# EAGLE design 240x240_v4 (EAGLE 9.6.2)
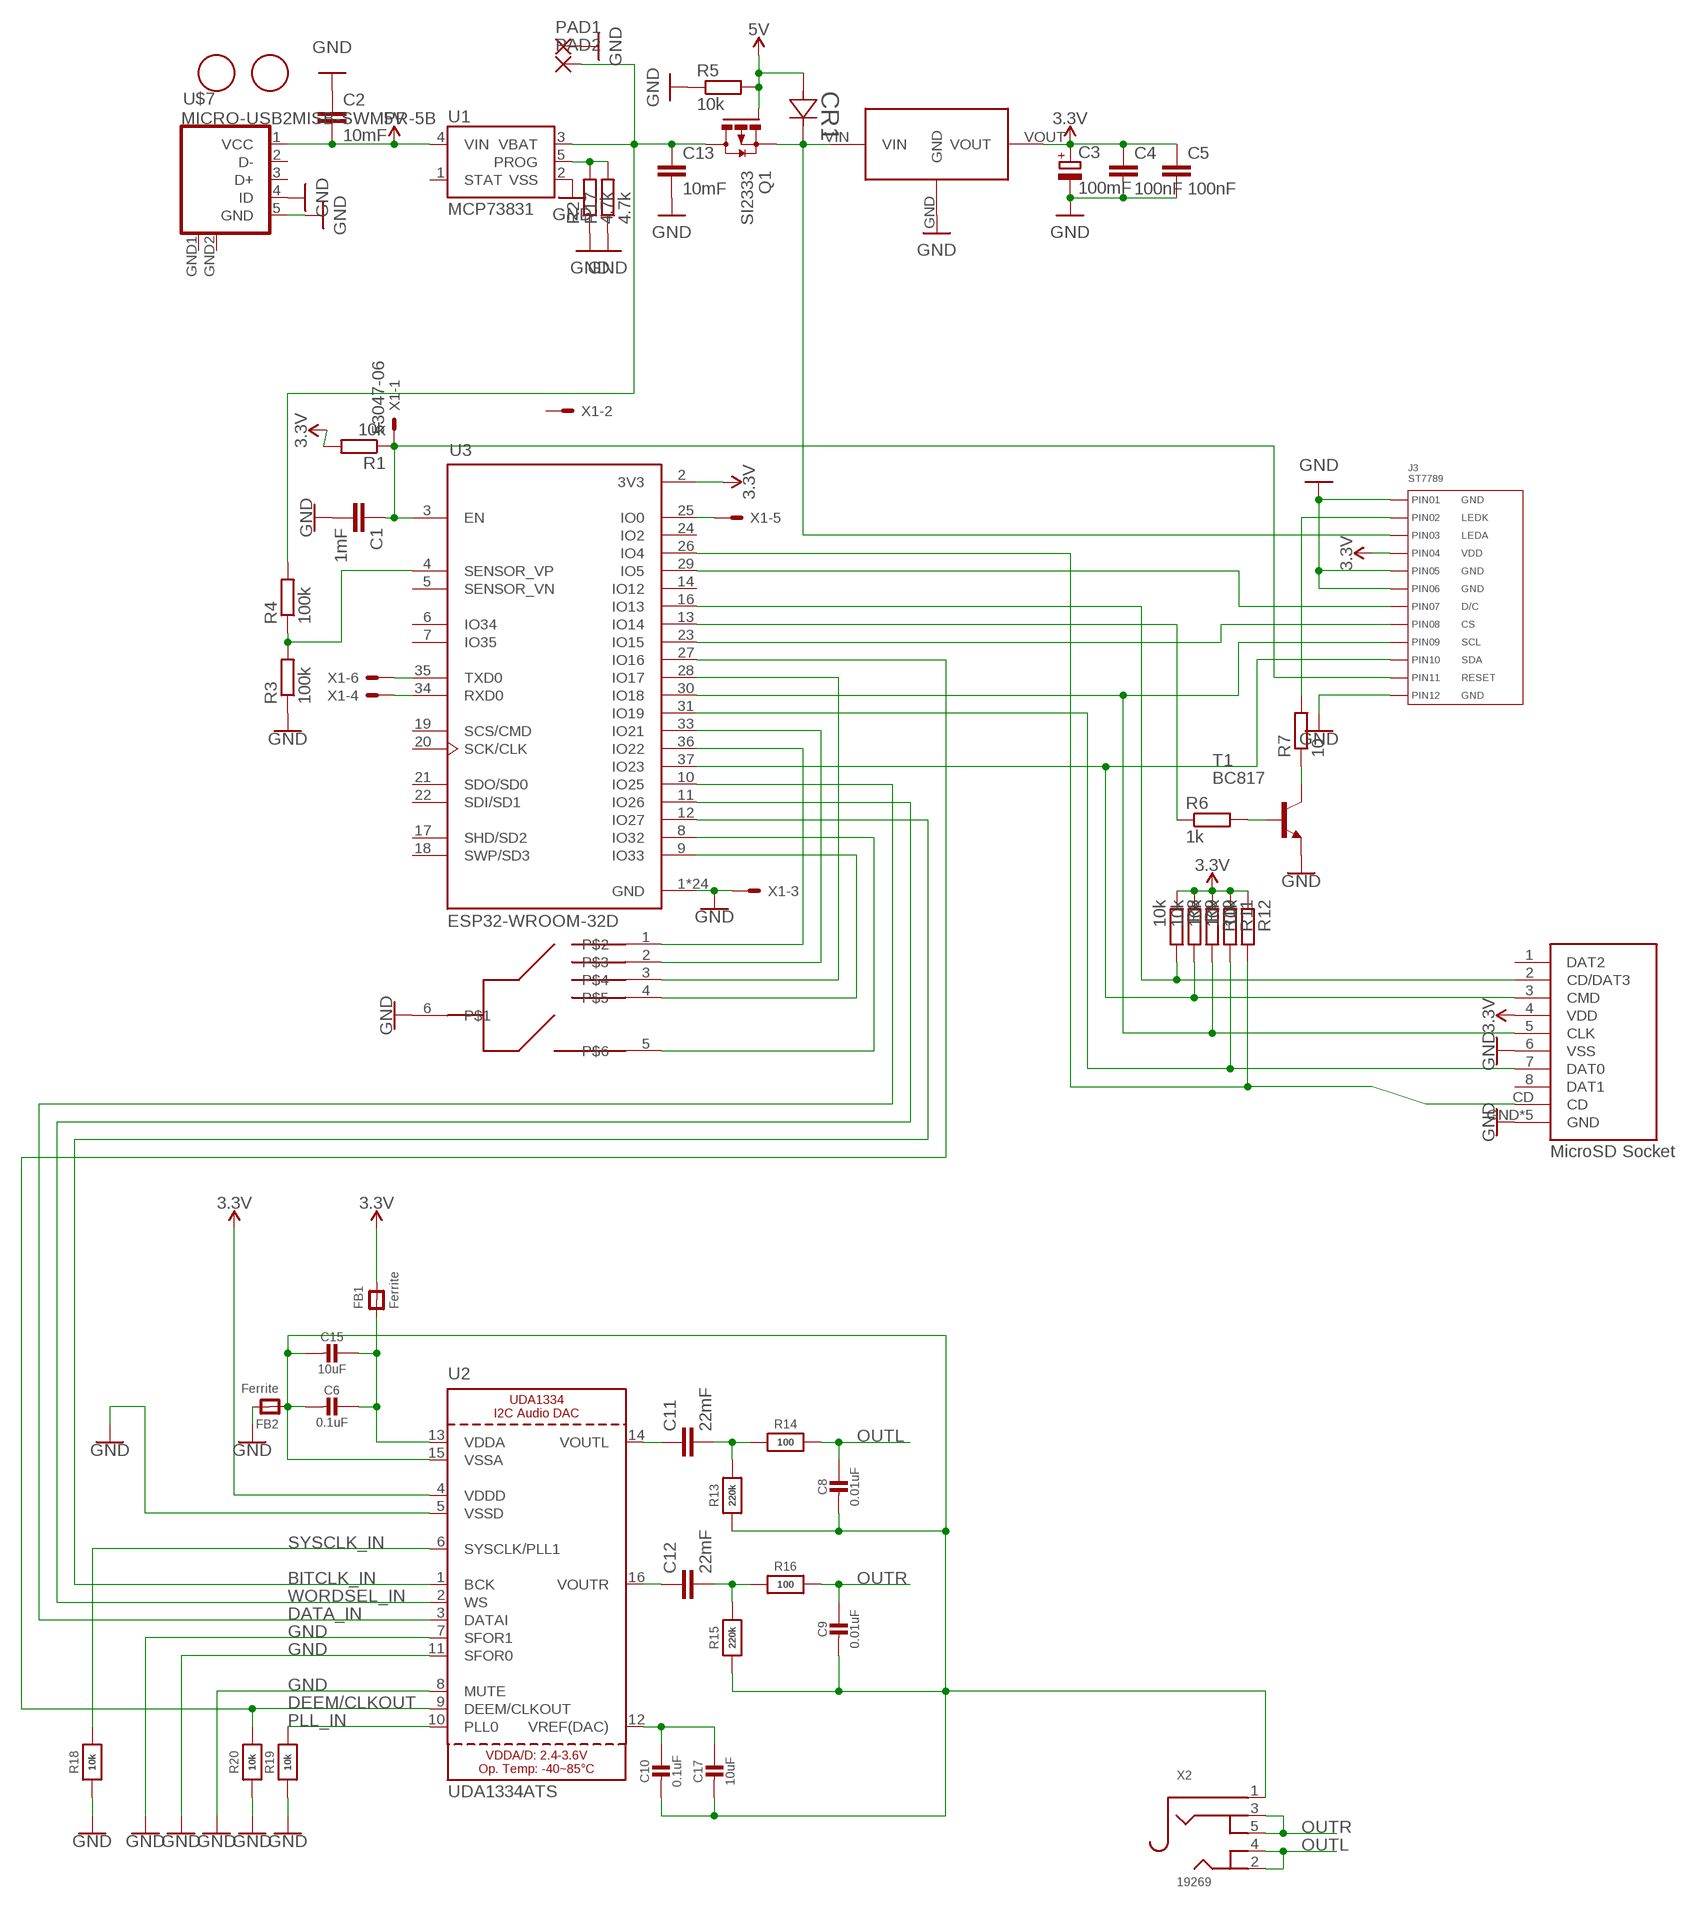
[diagram p0: schematic, sheet 1]

## Parts
C1  1mF  C-EUC0603  [C0603]
C2  10mF  C-EUC0603  [C0603]
C3  100mF  CPOL-EUSMCB  [SMC_B]
C4  100nF  C-EUC0805K  [C0805K]
C5  100nF  C-EUC0805K  [C0805K]
C6  0.1uF  CAP_CERAMIC0805-NOOUTLINE  [0805-NO]
C8  0.01uF  CAP_CERAMIC0805-NOOUTLINE  [0805-NO]
C9  0.01uF  CAP_CERAMIC0805-NOOUTLINE  [0805-NO]
C10  0.1uF  CAP_CERAMIC0805-NOOUTLINE  [0805-NO]
C11  22mF  C-EUC1210  [C1210]
C12  22mF  C-EUC1210  [C1210]
C13  10mF  C-EUC0603  [C0603]
C15  10uF  CAP_CERAMIC0805-NOOUTLINE  [0805-NO]
C17  10uF  CAP_CERAMIC0805-NOOUTLINE  [0805-NO]
CR1  BAT48  BAT48ZFILMSOD-123_STM-M  [SOD-123_STM-M]
FB1  Ferrite  FERRITE0805  [0805]
FB2  Ferrite  FERRITE0805  [0805]
J3  ST7789  CON_01X12_ST7789_CONNECTOR  [ST7789_CONNECTOR]
PAD1  SMD2  [SMD1,27-2,54]
PAD2  SMD2  [SMD1,27-2,54]
Q1  SI2333  FDN360P  [SUPER-SOT3]
R1  10k  R-EU_R0603  [R0603]
R2  4.7k  R-EU_R0805  [R0805]
R3  100k  R-EU_R0603  [R0603]
R4  100k  R-EU_R0603  [R0603]
R5  10k  R-EU_R0603  [R0603]
R6  1k  R-EU_R0603  [R0603]
R7  10  R-EU_R0805  [R0805]
R8  10k  R-EU_R0603  [R0603]
R9  10k  R-EU_R0603  [R0603]
R10  10k  R-EU_R0603  [R0603]
R11  10k  R-EU_R0603  [R0603]
R12  10k  R-EU_R0603  [R0603]
R13  220k  RESISTOR0805_NOOUTLINE  [0805-NO]
R14  100  RESISTOR0805_NOOUTLINE  [0805-NO]
R15  220k  RESISTOR0805_NOOUTLINE  [0805-NO]
R16  100  RESISTOR0805_NOOUTLINE  [0805-NO]
R17  4.7k  R-EU_R0805  [R0805]
R18  10k  RESISTOR_0603_NOOUT  [0603-NO]
R19  10k  RESISTOR_0603_NOOUT  [0603-NO]
R20  10k  RESISTOR_0603_NOOUT  [0603-NO]
T1  BC817  BC817-16-NPN-SOT23-BEC  [SOT23-BEC]
U1  MCP73831  [SOT23-5]
U2  UDA1334ATS  AUDIO_I2S_UDA1334""  [SSOP16_4.4MM]
U3  ESP32-WROOM-32D  [MODULE_ESP32-WROOM-32D]
U$1  XC6203  HT7333  [SOT89]
U$2  B5-P5S-0D  [B5-P5S-0D-Z]
U$3  FIDUCIAL  [FIDUCIAL_1MM]
U$4  FIDUCIAL  [FIDUCIAL_1MM]
U$5  ATTEND_MICROSD_SOCKET  [ATTEND_MICROSD_SOCKET]
U$7  MICRO-USB2MISB-SWMPR-5B  [MICRO-USB2]
X1  53047-06  [53047-06]
X2  19269  AUDIO_3.5MMJACK  [4UCONN_19269]

## Nets
3.3V [Power]: C3.+ C4.1 C5.1 FB1.2 J3.P$4 R1.2 R8.1 R9.1 R10.1 R11.1 R12.1 U2.4(VDDD) U3.2(3V3) U$1.VOUT U$5.4(VDD)
5V [Power]: C2.2 CR1.1 Q1.1(G) R5.2 U1.4(VIN) U$7.1(VCC)
BITCLK_IN: U2.1(BCK) U3.12(IO27)
DATA_IN: U2.3(DATAI) U3.10(IO25)
DEEM/CLKOUT: R20.2 U2.9(DEEM/CLKOUT) U3.27(IO16)
GND [Power]: C1.2 C2.1 C3.- C4.2 C5.2 C13.2 FB2.2 J3.P$1 J3.P$5 J3.P$6 J3.P$12 PAD1.1(P) R2.1 R3.1 R5.1 R17.1 R18.1 R19.1 R20.1 T1.E U1.2(VSS) U2.5(VSSD) U2.7(SFOR1) U2.8(MUTE) U2.11(SFOR0) U3.1(GND) U3.15(GND) U3.38(GND) U3.39_1(GND) U3.39_2(GND) U3.39_3(GND) U3.39_4(GND) U3.39_5(GND) U3.39_6(GND) U3.39_7(GND) U3.39_8(GND) U3.39_9(GND) U3.39_10(GND) U3.39_11(GND) U3.39_12(GND) U3.39_13(GND) U3.39_14(GND) U3.39_15(GND) U3.39_16(GND) U3.39_17(GND) U3.39_18(GND) U3.39_19(GND) U3.39_20(GND) U3.39_21(GND) U$1.GND U$2.6 U$5.6(VSS) U$5.GND U$5.GND2(GND) U$5.GND3(GND) U$5.GND4(GND) U$5.GND5(GND) U$7.4(ID) U$7.5(GND) X1.3
N$1: C1.1 J3.P$11 R1.1 U3.3(EN) X1.1
N$2: J3.P$9 R10.2 U3.30(IO18) U$5.5(CLK)
N$3: J3.P$10 R9.2 U3.37(IO23) U$5.3(CMD)
N$5: J3.P$7 U3.29(IO5)
N$6: J3.P$8 U3.23(IO15)
N$7: U3.35(TXD0) X1.6
N$8: U3.34(RXD0) X1.4
N$9: R3.2 R4.1 U3.4(SENSOR_VP)
N$10: R6.2 T1.B
N$11: U3.36(IO22) U$2.1
N$12: R2.2 R17.2 U1.5(PROG)
N$13: J3.P$2 R7.2
N$14: U3.33(IO21) U$2.2
N$15: U3.28(IO17) U$2.3
N$16: U3.9(IO33) U$2.4
N$17: U3.8(IO32) U$2.5
N$18: R11.2 U3.31(IO19) U$5.7(DAT0)
N$19 [Power]: C13.1 PAD2.1(P) Q1.3(D) R4.2 U1.3(VBAT)
N$20: U3.25(IO0) X1.5
N$21: R7.1 T1.C
N$22: R6.1 U3.13(IO14)
N$23: R8.2 U3.16(IO13) U$5.2(CD/DAT3)
N$24: R12.2 U3.26(IO4) U$5.CD
N$25: C6.1 C15.1 FB1.1 U2.13(VDDA)
N$26: C11.2 R13.2 R14.1
N$27: C12.2 R15.2 R16.1
N$28: C10.1 C17.1 U2.12(VREF(DAC))
N$29: C12.1 U2.16(VOUTR)
N$30: C11.1 U2.14(VOUTL)
N$31: CR1.2 J3.P$3 Q1.2(S) U$1.VIN
N$34: C6.2 C8.2 C9.2 C10.2 C15.2 C17.2 FB2.1 R13.1 R15.1 U2.15(VSSA) X2.1
OUTL: C8.1 R14.2 X2.2 X2.4
OUTR: C9.1 R16.2 X2.3 X2.5
PLL_IN: R19.2 U2.10(PLL0)
SYSCLK_IN: R18.2 U2.6(SYSCLK/PLL1)
WORDSEL_IN: U2.2(WS) U3.11(IO26)
Unconnected: U1.1(STAT) U3.5(SENSOR_VN) U3.6(IO34) U3.7(IO35) U3.14(IO12) U3.17(SHD/SD2) U3.18(SWP/SD3) U3.19(SCS/CMD) U3.20(SCK/CLK) U3.21(SDO/SD0) U3.22(SDI/SD1) U3.24(IO2) U$5.1(DAT2) U$5.8(DAT1) U$7.2(D-) U$7.3(D+) X1.2

## Power pins joined to a net without a drawn wire
GND: U$7.GND1(GND) U$7.GND2(GND)

## Library data of the parts
C1 C2 C4 C5 C11-C13 = rcl:C-EU: CAPACITOR, European symbol; SPICEPREFIX: C
C3 = rcl:CPOL-EU: POLARIZED CAPACITOR, European symbol; SPICEPREFIX: C
C6 C8-C10 C15 C17 = microbuilder:CAP_CERAMIC: Ceramic Capacitors For new designs, use the packages preceded by an '_' character since they are more reliable: The following footprints should be used on most boards: _0402 - Standard footprint for regular board layouts _0603 - Standard footprint for regular board layouts _0805 - Standard footprint for regular board layouts _1206 - Standard footprint for regular board layouts For extremely tight-pitch boards where space is at a premium, the following 'micro-pitch' footprints can be used (smaller pads, no silkscreen outline, etc.): _0402MP - Micro-pitch footprint for very dense/compact boards _0603MP - Micro-pitch footprint for very dense/compact boards _0805MP - Micro-pitch footprint for very dense/compact boards _1206MP - Micro-pitch footprint for very dense/compact boards
CR1 = BAT48:BAT48ZFILM; COPYRIGHT: Copyright (C) 2021 Ultra Librarian. All rights reserved.; MANUFACTURER_PART_NUMBER: BAT48ZFILM; MFR_NAME: STMicroelectronics
FB1 FB2 = microbuilder:FERRITE: Ferrite Bead 0603 MMZ1608B121C - 120 Ohm @ 100MHz, 600mA, 0.15 Ohm DC Resistance - Digikey: 445-2164-1-ND BK1608HW121-T - 120 Ohm, 600mA Ferrite Chip - Digikey: 587-1876-2-ND 0805 HZ0805B272R-10 - 2.7K Ohm @ 100MHz, 200mA, 0.8 Ohm DC Resistance - Digikey: 240-2504-1-ND (see also Murata BLM21BD272SN1L) MMZ2012Y152B - 1.5K Ohm @ 100MHz, 500mA, 0.4 Ohm DC Resistance - Digikey: 445-1560-1-ND - Mainly for high frequency (80-400MHz) MMZ2012R102A - 1K Ohm @ 100MHz, 500mA, 0.3 Ohm DC Resistance - Digikey: 445-1555-2-ND - More general purpose (10-200MHz)
J3 = PP_Connectors:CON_01X12; LABEL01: GND; LABEL02: LEDK; LABEL03: LEDA; LABEL04: VDD; LABEL05: GND; LABEL06: GND; LABEL07: D/C; LABEL08: CS; LABEL09: SCL; LABEL10: SDA; LABEL11: RESET; LABEL12: GND; POPULATE: 0
PAD1 PAD2 = wirepad:SMD2: SMD PAD
Q1 = transistor-power:FDN360P: Single P-Channel, PowerTrench (R) MOSFET Source: http://www.fairchildsemi.com/ds/FD/FDN360P.pdf
R1-R12 R17 = rcl:R-EU_: RESISTOR, European symbol; SPICEPREFIX: R
R13-R16 R18-R20 = microbuilder:RESISTOR: Resistors For new designs, use the packages preceded by an '_' character since they are more reliable: The following footprints should be used on most boards: _0402 - Standard footprint for regular board layouts _0603 - Standard footprint for regular board layouts _0805 - Standard footprint for regular board layouts _1206 - Standard footprint for regular board layouts For extremely tight-pitch boards where space is at a premium, the following 'micro-pitch' footprints can be used (smaller pads, no silkscreen outline, etc.): _0402MP - Micro-pitch footprint for very dense/compact boards _0603MP - Micro-pitch footprint for very dense/compact boards _0805MP - Micro-pitch footprint for very dense/compact boards _1206MP - Micro-pitch footprint for very dense/compact boards
T1 = transistor:*-NPN-: NPN Transistror BF959 corrected 2008.03.06
U1 = SparkFun-IC-Power:MCP73831: MCP73831T Li-Ion, Li-Pol Controller Miniature single cell, fully integrated Li-Ion, Li-polymer charge management controller Datasheet <http://ww1.microchip.com/downloads/en/DeviceDoc/20001984g.pdf> SparkFun Products: SparkFun ESP32 Thing <https://www.sparkfun.com/products/13907> SparkFun 9DoF Razor IMU M0 <https://www.sparkfun.com/products/14001>; PROD_ID: IC-09995
U2 = microbuilder:AUDIO_I2S_UDA1334: UDA1334 I2C Audio DAC Power Supply: 2.4-3.6V Sample frequencies from 16-100kHz
U3 = ESP32-WROOM-32D_EDIT:ESP32-WROOM-32D: Bluetooth, WiFi 802.11b/g/n, Bluetooth v4.2 + EDR, Class 1, 2 and 3 Transceiver Module 2.4GHz ~ 2.5GHz Integrated, Trace Surface Mount Check prices <https://pricing.snapeda.com/parts/ESP32-WROOM-32D/Espressif%20Systems/view-part?ref=eda>; AVAILABILITY: Bad; DESCRIPTION: Bluetooth, WiFi 802.11b/g/n, Bluetooth v4.2 +EDR, Class 1, 2 and 3 Transceiver Module 2.4GHz ~ 2.5GHz Integrated, Trace Surface Mount; MF: Espressif Systems; MP: ESP32-WROOM-32D; PACKAGE: Module Espressif Systems; PRICE: None
U$1 = HT7333_SOT89:HT7333
U$2 = zippy B5:B5-P5S-0D
U$3 U$4 = adafruit:FIDUCIAL: For use by pick and place machines to calibrate the vision/machine, 1mm By microbuilder.eu
U$5 = ATTEND MicroSD Card Socket:ATTEND_MICROSD_SOCKET
U$7 = MicroUSB:MICRO-USB2: Micro USB B connector
X1 = con-molex:53?-06: CONNECTOR wire to board 1.25 mm (.049 inch) pitch header; MF: MOLEX; MPN: 53047-0610-C; OC_FARNELL: 9733078; OC_NEWARK: 03M2965
X2 = microbuilder:AUDIO_3.5MMJACK: 3.5MM Audio Jack These are normally connected as follows, from left-to right on the schematic symbol above: Tip: Left Audio Inner Ring: Right Audio Shell: Common/GND

## Net classes
1 Power: width 0.406 mm

## Board
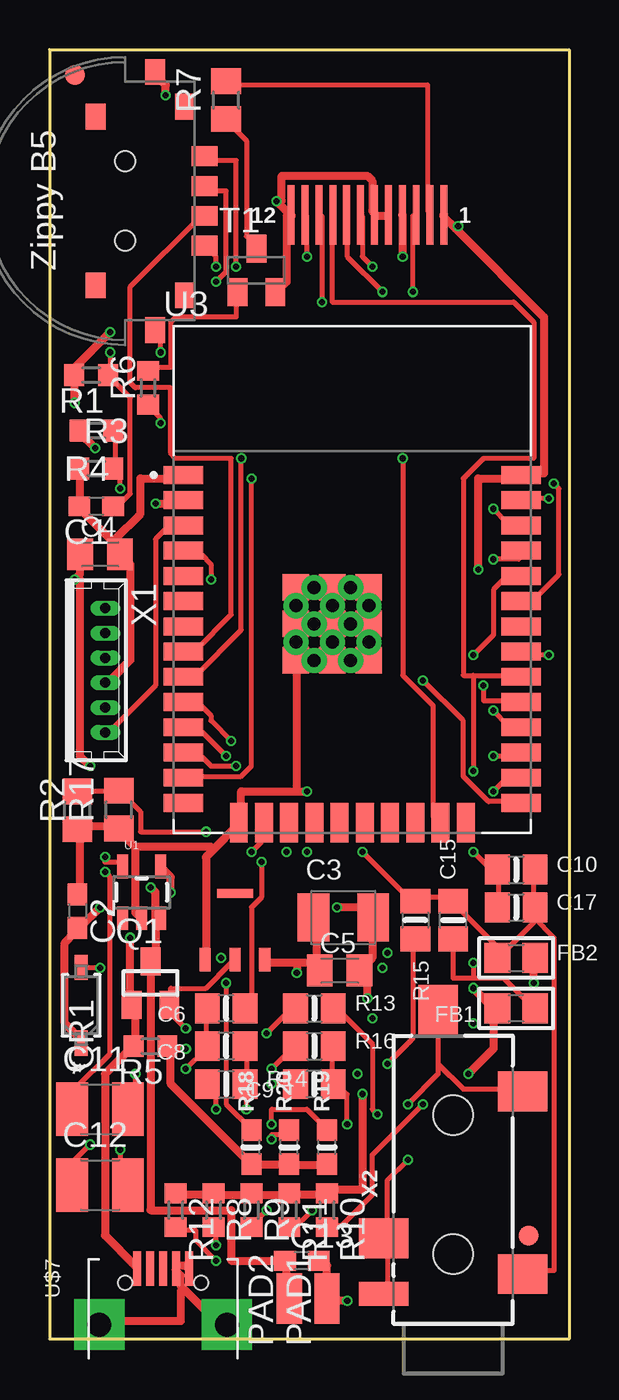
[diagram p1: board, top side]
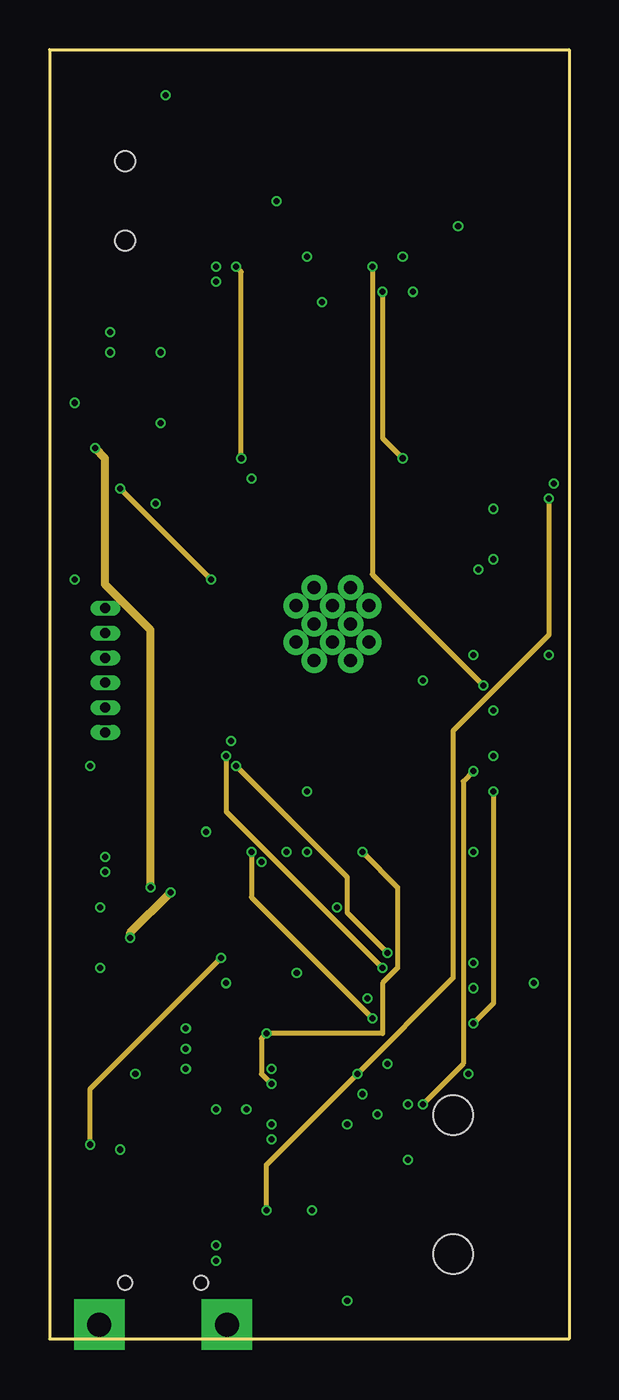
[diagram p2: board, inner layer Route2]
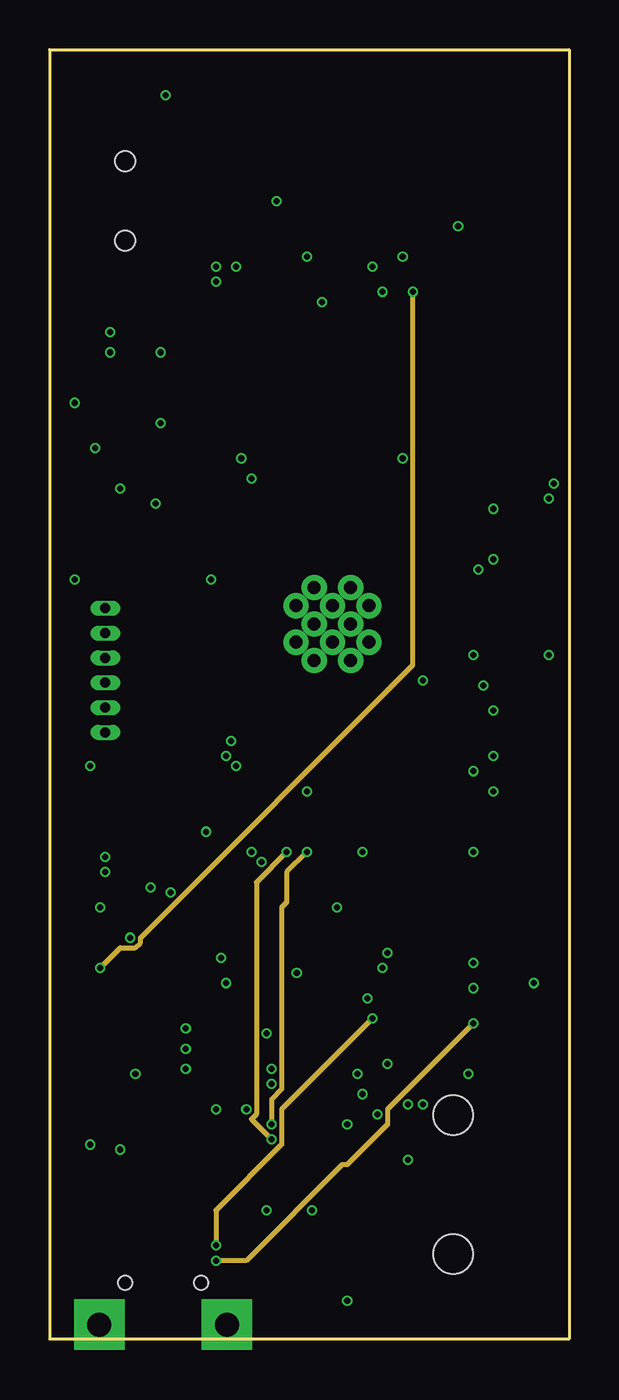
[diagram p3: board, inner layer Route15]
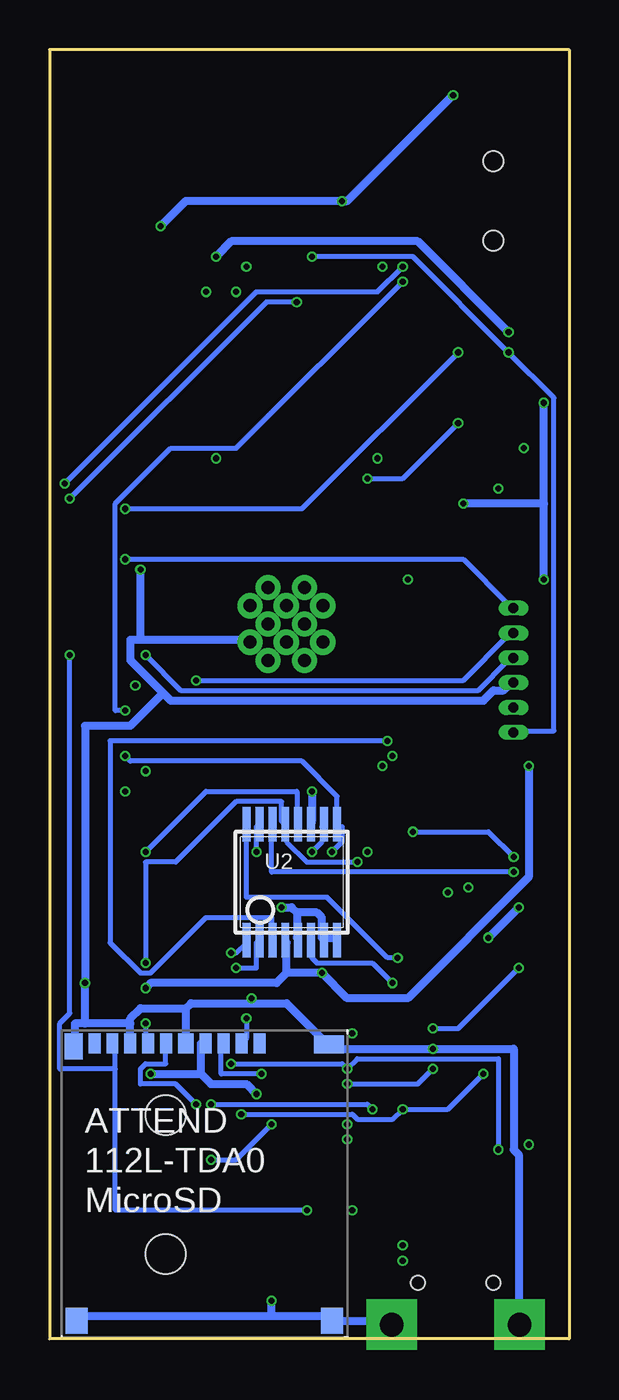
[diagram p4: board, bottom side, seen from below]

Size 26.16 x 64.9 mm. Coordinates in mm from the lower left corner, seen from the top.
Outline: 0,64.9 26.16,64.9 26.16,0 0,0 0,64.9
Copper layers (1+2*15+16): Top 0.035mm / dielectric 0.23mm / Route2 0.035mm / dielectric 0.93mm / Route15 0.035mm / dielectric 0.23mm / Bottom 0.035mm
Design rules "MF_Standard_4_Layer *": minimum track width 10mil, minimum drill 12mil, track to track 5mil, track to pad 5mil, pad to pad 5mil, via to via 5mil, smd to smd 0mil, copper to edge 10mil, drill to drill 10mil, minimum pad ring 4mil, minimum via ring 4mil, stop-mask expansion 2mil, vias tented up to drill 25mil, thermal gap 10mil

### Footprints (pad centres in the part's own frame; a part is rotated, then mirrored left to right if it is on the bottom)
C0603 = smd 1.1 x 1: 1 -0.85,0; 2 0.85,0
SMC_B = smd 1.6 x 2.4: + -1.5,0; - 1.5,0
C0805K = smd 1.3 x 1.6: 1 -1,0; 2 1,0
0805-NO = smd 1.24 x 1.5: 1 -0.95,0; 2 0.95,0
C1210 = smd 1.6 x 2.7: 1 -1.4,0; 2 1.4,0
SOD-123_STM-M = smd 1.27 x 0.66: 1 -1.905,0; 2 1.905,0
0805 = smd 1.3 x 1.5: 1 -0.95,0; 2 0.95,0
ST7789_CONNECTOR = smd 0.35 x 3: P$1 -3.85,0; P$2 -3.15,0; P$3 -2.45,0; P$4 -1.75,0; P$5 -1.05,0; P$6 -0.35,0; P$7 0.35,0; P$8 1.05,0; P$9 1.75,0; P$10 2.45,0; P$11 3.15,0; P$12 3.85,0
SMD1,27-2,54 = smd 1.27 x 2.54: 1 0,0
SUPER-SOT3 = smd 1 x 1.4: 1 -0.95,-1.1; 2 0.95,-1.1; 3 0,1.1
R0603 = smd 1 x 1.1: 1 -0.85,0; 2 0.85,0
R0805 = smd 1.3 x 1.5: 1 -0.95,0; 2 0.95,0
0603-NO = smd 1.075 x 1: 1 -0.85,0; 2 0.85,0
SOT23-BEC = smd 1 x 1.4: B -0.95,-1.1; C 0,1.1; E 0.95,-1.1
SOT23-5 = smd 0.55 x 1.2: 1 -0.95,-1.3; 2 0,-1.3; 3 0.95,-1.3; 4 0.95,1.3; 5 -0.95,1.3
SSOP16_4.4MM = smd 0.4 x 1.75: 1 -2.275,-2.92; 2 -1.625,-2.92; 3 -0.975,-2.92; 4 -0.325,-2.92; 5 0.325,-2.92; 6 0.975,-2.92; 7 1.625,-2.92; 8 2.275,-2.92; 9 2.275,2.92; 10 1.625,2.92; 11 0.975,2.92; 12 0.325,2.92; 13 -0.325,2.92; 14 -0.975,2.92; 15 -1.625,2.92; 16 -2.275,2.92
MODULE_ESP32-WROOM-32D = smd 2 x 0.9: 1 -8.5,5.26; 2 -8.5,3.99; 3 -8.5,2.72; 4 -8.5,1.45; 5 -8.5,0.18; 6 -8.5,-1.09; 7 -8.5,-2.36; 8 -8.5,-3.63; 9 -8.5,-4.9; 10 -8.5,-6.17; 11 -8.5,-7.44; 12 -8.5,-8.71; 13 -8.5,-9.98; 14 -8.5,-11.25; 25 8.5,-11.25; 26 8.5,-9.98; 27 8.5,-8.71; 28 8.5,-7.44; 29 8.5,-6.17; 30 8.5,-4.9; 31 8.5,-3.63; 32 8.5,-2.36; 33 8.5,-1.09; 34 8.5,0.18; 35 8.5,1.45; 36 8.5,2.72; 37 8.5,3.99; 38 8.5,5.26 | smd 0.9 x 2: 15 -5.715,-12.25; 16 -4.445,-12.25; 17 -3.175,-12.25; 18 -1.905,-12.25; 19 -0.635,-12.25; 20 0.635,-12.25; 21 1.905,-12.25; 22 3.175,-12.25; 23 4.445,-12.25; 24 5.715,-12.25 | smd 1.33 x 1.33: 39_1 -2.835,-0.405; 39_2 -1,-0.405; 39_3 0.835,-0.405; 39_4 -2.835,-2.24; 39_5 -1,-2.24; 39_6 0.835,-2.24; 39_7 -2.835,-4.075; 39_8 -1,-4.075; 39_9 0.835,-4.075 | drill 0.65 pad 1.27: 39_10 -1.917,-0.405; 39_11 -0.083,-0.405; 39_12 -2.835,-1.323; 39_13 -1,-1.323; 39_14 0.835,-1.323; 39_15 -1.917,-2.24; 39_16 -0.083,-2.24; 39_17 -2.835,-3.158; 39_18 -1,-3.158; 39_19 0.835,-3.158; 39_20 -1.917,-4.075; 39_21 -0.083,-4.075
SOT89 = smd 0.559 x 1.194: GND -1.499,-0.597; VIN 0,-0.597; VOUT 1.499,-0.597 | smd 1.829 x 0.457: P$4 0,2.743
B5-P5S-0D-Z = smd 1.3 x 1: 1 -6.5,-1.5; 6 6.5,-1.5; P$5 -4.75,-3; P$6 4.75,-3; P$9 -4.25,1.5; P$10 4.25,1.5 | smd 1 x 1.3: 2 -2.25,-4; 3 0.75,-4; 4 2.25,-4; 5 -0.75,-4 | hole 1: -2,0; 2,0
FIDUCIAL_1MM = smd 1 x 1: 1 0,0
ATTEND_MICROSD_SOCKET = smd 0.6 x 1: 1 9.8,-0.5; 2 8.9,-0.5; 3 8,-0.5; 4 7.1,-0.5; 5 5.1,-0.5; 6 3.3,-0.5; 7 2.4,-0.5; 8 1.5,-0.5; CD 4.2,-0.5 | smd 0.9 x 1.3: GND 0.45,-0.65 | smd 1.5 x 0.9: GND2 13.3,-0.55 | smd 1.1 x 1.3: GND3 0.6,-14.45; GND4 13.45,-14.45 | smd 0.8 x 1: GND5 6.1,-0.5
MICRO-USB2 = smd 0.4 x 1.75: 1 -1.3,1.985; 2 -0.65,1.985; 3 0,1.985; 4 0.65,1.985; 5 1.3,1.985 | drill 1.2 pad 2.54 square: GND1 -3.217,-0.84; GND2 3.217,-0.84 | hole 0.7: -1.905,1.27; 1.905,1.27
53047-06 = drill 0.5 pad 0.698 long: 1 3.125,0.45; 2 1.875,0.45; 3 0.625,0.45; 4 -0.625,0.45; 5 -1.875,0.45; 6 -3.125,0.45
4UCONN_19269 = smd 2 x 2.5: 1 2.5,-3.5; 2 11.7,-3.5; 3 4.3,3.5 | smd 2.5 x 2: 4 15.8,0.75 | smd 1.2 x 2.5: 5 1.5,3.5 | hole 2: 3.5,0; 10.5,0

### Placement (x,y rotation side)
C1  2.35,41.91 180 top
C2  1.4,21.53 270 top
C3  14.8,21.21 0 top
C4  2.54,39.5 0 top
C5  14.61,18.54 0 top
C6  8.89,16.64 180 top
C8  8.89,14.73 180 top
C9  13.34,12.83 180 top
C10  23.5,23.62 0 top
C11  2.54,11.56 0 top
C12  2.54,7.75 0 top
C13  12.7,3.94 0 top
C15  20.32,21.08 90 top
C17  23.5,21.72 0 top
CR1  1.59,16.8 90 top
FB1  23.5,16.64 180 top
FB2  23.5,19.18 0 top
J3  16.01,56.58 180 top
PAD1  13.97,2.03 0 top
PAD2  12.06,2.03 0 top
Q1  5.08,17.91 0 top
R1  2.1,48.51 180 top
R2  1.4,26.61 90 top
R3  2.35,43.82 0 top
R4  2.35,45.72 180 top
R5  5.08,14.73 180 top
R6  4.95,47.88 90 top
R7  8.89,62.36 90 top
R8  8.26,6.48 270 top
R9  10.16,6.48 270 top
R10  13.97,6.48 270 top
R11  12.06,6.48 270 top
R12  6.35,6.48 270 top
R13  13.34,16.64 0 top
R14  8.89,12.83 0 top
R15  18.41,21.08 270 top
R16  13.34,14.73 0 top
R17  3.49,26.64 90 top
R18  10.16,9.65 90 top
R19  13.97,9.65 90 top
R20  12.06,9.65 90 top
T1  10.41,53.78 0 top
U1  4.64,22.48 0 top
U2  13.97,22.99 0 bottom
U3  15.24,38.23 0 top
U$1  9.33,19.69 0 top
U$2  3.81,57.28 90 top
U$3  1.27,63.63 0 top
U$4  24.13,5.21 0 top
U$5  25.4,15.37 0 bottom
U$7  5.71,1.56 0 top
X1  2.35,33.66 270 top
X2  20.32,0.76 90 top

### Tracks (layer width: path | path; a pad name or v marks a point on that pad's centre or on a via)
3.3V  (via drill 0.3)
  Top 0.406: R12.1 6.35,7.24 8.13,7.24 R8.1 8.38,7.24 10.16,7.24 | 10.16,7.24 11.94,7.24 R11.1 12.19,7.24 13.97,7.24 R10.1 13.97,7.49 15.75,7.49 v15.75,12.32 | 10.16,7.24 R9.1 | v21.08,13.34 22.35,14.61 22.35,16.64 | 13.46,18.92 12.45,18.92 | 12.45,18.92 10.92,18.92 U$1.VOUT | 13.46,18.92 13.46,18.67 C5.1 13.46,18.92 | 12.45,18.92 v12.45,18.42 | 13.46,18.92 13.46,21.21 C3.+ | v21.34,17.65 22.35,16.64 | 22.35,16.64 FB1.2 | v1.27,47.12 1.27,48.39 R1.2 1.27,48.64 1.27,48.9 v3.05,50.67 | 1.4,38.35 1.52,38.48 1.52,39.5 C4.1 | 1.4,38.35 v1.27,38.23 | v5.33,42.04 6.6,42.04 U3.2 | v17.78,54.48 17.78,56.52 J3.P$4 | v2.03,28.83 1.52,29.34 1.52,38.23 1.4,38.35
  Bottom 0.406: 18.54,13.34 18.54,14.86 U$5.4 | v21.08,13.34 18.54,13.34 | 14.22,18.42 14.22,19.94 U2.4 | 14.22,18.42 v12.45,18.42 11.18,17.15 8.13,17.15 2.03,23.24 v2.03,28.83 | v21.34,17.65 21.08,17.91 14.73,17.91 14.22,18.42 | v15.75,12.32 16.26,12.83 18.03,12.83 18.54,13.34 | v1.27,38.23 1.27,42.04 | 1.27,42.04 v1.27,47.12 | 1.27,42.04 v5.33,42.04 | v17.78,54.48 17.02,55.25 7.62,55.25 v3.05,50.67
5V  (via drill 0.3)
  Top 0.406: CR1.1 1.52,15.11 0.76,15.88 0.76,19.94 1.27,20.45 C2.2 1.52,20.7 v2.54,21.72 | v6.1,22.48 6.1,23.24 5.59,23.75 U1.4 | v4.06,20.19 4.06,16.89 Q1.1 4.32,16.64 4.32,14.86 R5.2 4.06,14.61 2.79,13.34 2.79,5.21 4.32,3.68 U$7.1
  Route2 0.406: v6.1,22.48 4.06,20.45 v4.06,20.19
  Bottom 0.406: v4.06,20.19 v2.54,21.72
BITCLK_IN  (via drill 0.3)
  Top 0.254: v9.4,28.83 8.13,28.83 7.62,29.34 6.86,29.34 U3.12
  Route2 0.254: v17.02,19.43 14.99,21.46 14.99,23.24 v9.4,28.83
  Bottom 0.254: v17.02,19.43 16.76,19.43 16.26,19.94 U2.1
DATA_IN  (via drill 0.3)
  Top 0.254: v9.14,30.1 8.13,31.12 8.13,31.37 7.62,31.88 6.86,31.88 U3.10
  Bottom 0.254: v9.14,30.1 23.11,30.1 23.11,19.94 21.59,18.42 21.08,18.42 18.29,21.21 14.99,21.21 14.99,20.19 U2.3
DEEM/CLKOUT  (via drill 0.3)
  Top 0.254: v11.18,10.03 11.18,10.29 11.94,10.29 R20.2 | v22.35,29.34 23.62,29.34 U3.27
  Route15 0.254: v11.18,10.03 10.16,11.05 10.41,11.3 10.41,22.99 v11.94,24.51
  Bottom 0.254: v11.94,24.51 11.43,25.02 11.43,25.78 11.68,25.78 U2.9 11.68,26.04 11.68,27.31 13.46,29.08 22.1,29.08 v22.35,29.34
GND  (via drill 0.3)
  Top 0.406: C13.2 13.72,3.94 13.97,3.68 PAD1.1 13.97,1.91 v14.99,1.91 | U$7.5 6.86,3.68 6.35,3.68 U$7.4 6.35,3.43 6.6,3.18 6.6,2.67 6.73,2.54 | 6.73,2.54 8.38,0.89 8.89,0.89 U$7.GND2 | U$7.GND1 2.54,0.89 6.6,0.89 6.6,2.41 6.73,2.54 | 10.16,8.76 11.94,8.76 R20.1 12.19,8.76 13.97,8.76 R19.1 | 6.1,14.61 6.1,12.83 10.16,8.76 | 10.16,8.76 R18.1 | 16.26,21.21 16.26,19.18 15.75,18.67 C5.2 15.75,18.42 16,18.16 v16,17.15 | v14.48,21.72 16.26,21.72 16.26,21.21 | 16.26,21.21 C3.- | v24.38,17.91 24.38,19.18 FB2.2 | v6.86,14.61 6.1,14.61 | 6.1,14.61 R5.1 | 20.45,55.88 19.81,56.52 J3.P$1 | 20.45,55.88 24.89,51.44 24.89,43.56 23.88,43.56 U3.38 23.62,43.31 21.59,43.31 v21.59,38.74 | J3.P$5 17.02,56.52 16.51,56.52 J3.P$6 16.26,56.77 16.26,58.29 16,58.55 11.68,58.55 11.68,57.28 11.56,57.15 | v5.84,62.61 5.84,63.12 5.33,63.63 U$2.6 | 12.06,56.64 12.19,56.52 J3.P$12 | 12.06,56.64 11.56,57.15 | 11.56,57.15 v11.43,57.28 | T1.E 11.43,52.71 11.94,53.21 11.94,56.52 12.06,56.64 | v20.57,56.01 20.45,55.88 | R3.1 1.52,43.82 1.52,42.04 C1.2 1.52,41.78 3.3,40.01 3.3,39.5 C4.2 | X1.3 3.05,33.15 4.06,34.16 4.06,38.99 3.56,39.5 C4.2 | U3.1 6.6,43.31 4.57,43.31 4.57,41.53 3.3,40.26 C4.2 | U3.39_3 16,37.97 15.24,37.97 U3.39_11 14.99,37.97 14.48,37.97 U3.39_2 14.22,37.97 13.46,37.97 U3.39_10 13.21,37.97 12.45,37.97 U3.39_1 12.45,37.72 12.45,36.96 U3.39_12 12.45,36.7 12.45,36.2 | 12.45,36.2 13.21,36.2 U3.39_15 13.46,36.2 14.22,36.2 | 12.45,36.2 U3.39_4 | 14.22,36.2 14.22,36.7 U3.39_13 | U3.39_18 14.22,35.18 14.22,35.94 U3.39_5 | U3.39_5 14.48,36.2 14.99,36.2 U3.39_16 15.24,36.2 16,36.2 | 14.22,36.2 U3.39_5 | 12.45,34.16 12.45,34.93 U3.39_17
  Top 0.406: 12.45,34.16 13.21,34.16 U3.39_20 13.46,34.16 14.22,34.16 U3.39_8 14.48,34.16 14.99,34.16 U3.39_21 15.24,34.16 16,34.16 | 12.45,34.16 U3.39_7 12.45,33.91 12.45,27.56 | 16,36.2 16,36.7 U3.39_14 | 16,34.16 16,34.93 U3.39_19 16,35.18 16,35.94 U3.39_6 16,36.2 | 16,34.16 U3.39_9 | C2.1 1.52,22.48 1.52,25.53 R2.1 1.52,25.78 3.3,25.78 R17.1 3.56,25.53 4.32,24.77 | 4.32,24.77 4.32,21.46 4.57,21.21 U1.2 | 8.26,24.64 9.4,25.78 U3.15 9.65,26.04 9.65,27.56 12.45,27.56 | 8.26,24.64 7.87,24.26 7.87,19.18 U$1.GND | 12.45,27.56 v12.95,27.56 | 4.32,24.77 8.13,24.77 8.26,24.64
  Bottom 0.406: U$7.GND2 9.14,0.89 11.94,0.89 U$5.GND4 12.19,1.14 14.99,1.14 | 14.99,1.14 24.64,1.14 U$5.GND3 | 14.99,1.14 v14.99,1.91 | U2.8 11.68,20.19 12.19,20.19 U2.7 12.45,20.19 12.45,21.21 12.7,21.46 13.72,21.46 | 13.72,21.46 13.72,20.19 U2.5 | 13.72,21.46 13.97,21.72 v14.48,21.72 | 19.3,16.64 19.3,15.11 U$5.GND5 | 19.3,16.64 21.59,16.64 22.1,16.13 22.1,15.88 | 22.1,15.88 22.1,15.11 U$5.6 | 22.1,15.88 24.38,15.88 | 24.38,15.88 24.89,15.88 24.89,14.86 U$5.GND | 16,16.89 19.05,16.89 19.3,16.64 | 16,16.89 14.22,16.89 12.19,14.86 U$5.GND2 11.94,14.61 v6.86,14.61 2.79,14.61 2.79,9.53 2.54,9.27 2.54,0.89 U$7.GND1 | 24.38,15.88 v24.38,17.91 24.38,30.86 22.1,30.86 20.45,32.51 | 16,16.89 v16,17.15 | v5.84,62.61 11.18,57.28 v11.43,57.28 19.3,57.28 v20.57,56.01 | v12.95,27.56 12.95,26.04 U2.11 | 20.45,32.51 22.1,34.16 22.1,35.18 21.59,35.18 | 20.45,32.51 20.07,32.13 4.32,32.13 3.81,32.64 3.3,32.64 3.05,32.89 X1.3 | 21.59,35.18 16.26,35.18 U3.39_19 | 21.59,35.18 v21.59,38.74
N$1  (via drill 0.3)
  Top 0.254: C1.1 3.3,41.78 4.06,42.55 4.06,47.37 3.05,48.39 R1.1 3.05,48.64 v3.05,49.66 | X1.1 3.05,30.61 5.33,32.89 5.33,40.26 5.84,40.77 6.6,40.77 U3.3 | v12.95,54.48 12.95,56.52 J3.P$11
  Bottom 0.254: v12.95,54.48 7.87,54.48 v3.05,49.66 0.76,47.37 0.76,30.61 2.79,30.61 X1.1
N$2  (via drill 0.3)
  Top 0.254: v18.8,11.81 16.26,9.27 16.26,7.24 14.73,5.72 13.97,5.72 R10.2 | 21.34,33.4 20.83,33.4 20.83,43.31 21.84,44.32 24.38,44.32 24.38,51.18 23.37,52.2 14.22,52.2 14.22,56.52 J3.P$9 | 21.34,33.4 23.62,33.4 U3.30 | 21.34,33.4 v21.34,28.58
  Route2 0.254: v18.8,11.81 20.83,13.84 20.83,28.07 v21.34,28.58
  Bottom 0.254: v18.8,11.81 19.81,12.83 21.59,12.83 21.59,13.59 21.34,13.84 20.32,13.84 20.32,14.86 U$5.5
N$3  (via drill 0.3)
  Top 0.254: v10.92,6.48 10.16,5.72 R9.2 | v25.15,42.29 23.88,42.29 U3.37 | v13.72,52.2 13.72,56.52 J3.P$10
  Route2 0.254: v10.92,6.48 10.92,8.76 v15.49,13.34 20.32,18.16 20.32,30.61 25.15,35.43 v25.15,42.29
  Bottom 0.254: v15.49,13.34 17.53,13.34 17.53,14.86 U$5.3 | v25.15,42.29 15.24,52.2 v13.72,52.2
N$5  (via drill 0.3)
  Top 0.254: v21.84,32.89 21.84,32.13 23.62,32.13 U3.29 | v16.26,53.98 15.75,54.48 15.75,56.52 J3.P$7
  Route2 0.254: v21.84,32.89 16.26,38.48 v16.26,53.98
N$6  (via drill 0.3)
  Top 0.254: v17.78,44.32 17.78,33.4 19.3,31.88 19.3,26.29 19.56,26.04 U3.23 | v16.76,52.71 14.99,54.48 14.99,56.52 J3.P$8
  Route2 0.254: v17.78,44.32 16.76,45.34 v16.76,52.71
N$7  (via drill 0.3)
  Top 0.254: v22.35,39.24 23.62,39.24 23.62,39.5 U3.35
  Bottom 0.254: v22.35,39.24 5.33,39.24 3.05,36.96 X1.6
N$8  (via drill 0.3)
  Top 0.254: v21.34,34.42 22.35,35.43 22.35,37.72 22.86,38.23 23.62,38.23 U3.34
  Bottom 0.254: v21.34,34.42 19.56,32.64 4.57,32.64 3.05,34.16 X1.4
N$9  (via drill 0.3)
  Top 0.254: 3.3,43.82 3.3,45.59 R4.1 | 3.3,43.82 3.56,43.56 v3.56,42.8 | v8.13,38.23 8.13,38.99 7.62,39.5 6.86,39.5 U3.4 | 3.3,43.82 R3.2
  Route2 0.254: v8.13,38.23 v3.56,42.8
N$10
  Top 0.254: R6.2 5.08,48.9 6.1,48.9 6.1,51.18 6.35,51.44 9.4,51.44 9.4,52.45 T1.B
N$11  (via drill 0.3)
  Top 0.254: v5.59,49.66 5.59,50.42 5.33,50.67 U$2.1 | v22.35,41.78 23.11,41.02 23.62,41.02 U3.36
  Bottom 0.254: v5.59,49.66 13.46,41.78 v22.35,41.78
N$12  (via drill 0.3)
  Top 0.254: v2.79,24.26 2.79,24 3.56,24 U1.5 | v7.87,25.53 4.57,25.53 4.57,26.54 3.56,27.56 R17.2 3.3,27.56 1.52,27.56 R2.2
  Bottom 0.254: v2.79,24.26 4.06,25.53 v7.87,25.53
N$13
  Top 0.254: R7.2 8.89,63.12 19.05,63.12 19.05,56.77 J3.P$2
N$14  (via drill 0.3)
  Top 0.254: v8.38,53.98 8.38,54.48 7.87,54.99 U$2.2 | v25.4,43.05 25.65,42.8 25.65,38.48 24.38,37.21 23.88,37.21 U3.33
  Bottom 0.254: v8.38,53.98 9.65,52.71 15.75,52.71 v25.4,43.05
N$15  (via drill 0.3)
  Top 0.254: v8.38,53.21 8.89,53.72 8.89,57.79 7.87,57.79 U$2.3 | v22.35,31.62 23.11,30.86 23.62,30.86 U3.28
  Bottom 0.254: v8.38,53.21 16.76,44.83 20.07,44.83 22.86,42.04 22.86,31.62 v22.35,31.62
N$16  (via drill 0.3)
  Top 0.254: v9.4,53.98 9.4,59.31 7.87,59.31 U$2.4 | v9.65,44.32 9.65,35.69 7.37,33.4 6.86,33.4 U3.9
  Route2 0.254: v9.4,53.98 9.65,53.72 v9.65,44.32
N$17
  Top 0.254: U$2.5 7.62,56.52 4.06,52.96 4.06,48.13 4.32,47.88 6.1,47.88 6.1,44.58 6.35,44.32 9.14,44.32 9.14,36.45 7.37,34.67 6.86,34.67 U3.8
N$18  (via drill 0.3)
  Top 0.254: v13.21,6.48 12.19,5.46 R11.2 | v25.15,34.42 23.88,34.42 U3.31
  Bottom 0.254: 22.86,13.59 22.86,6.48 v13.21,6.48 | 22.86,13.59 22.86,14.86 U$5.7 | v25.15,34.42 25.15,16.38 25.65,15.88 25.65,13.59 22.86,13.59
N$19  (via drill 0.3)
  Top 0.406: PAD2.1 11.94,2.16 11.94,3.94 C13.1 9.14,3.94 9.14,6.48 5.08,6.48 Q1.3 5.08,19.18 5.33,19.43 5.33,20.96 U1.3 5.33,21.21 5.33,22.48 v5.08,22.73 | v2.29,44.83 1.52,45.59 R4.2
  Route2 0.406: v2.29,44.83 2.79,44.32 2.79,37.97 5.08,35.69 v5.08,22.73
N$20  (via drill 0.3)
  Top 0.254: v18.8,33.15 20.83,31.12 20.83,28.32 22.1,27.05 23.62,27.05 U3.25
  Bottom 0.254: v18.8,33.15 5.33,33.15 3.05,35.43 X1.5
N$21
  Top 0.254: T1.C 10.41,54.99 9.91,55.5 9.91,60.33 8.89,61.34 R7.1
N$22  (via drill 0.3)
  Top 0.254: v5.59,46.1 5.59,46.36 5.08,46.86 R6.1 | v10.16,43.31 10.16,28.83 9.65,28.32 6.86,28.32 U3.13
  Bottom 0.254: v5.59,46.1 8.38,43.31 v10.16,43.31
N$23  (via drill 0.3)
  Top 0.254: v10.16,24.51 10.67,25.02 10.67,25.78 U3.16 | v8.38,4.7 8.38,5.46 R8.2
  Route2 0.254: v16.26,16.13 10.16,22.23 v10.16,24.51
  Route15 0.254: v8.38,4.7 8.38,6.48 11.68,9.78 11.68,11.56 v16.26,16.13
  Bottom 0.254: v16.26,16.13 16.26,15.11 U$5.2
N$24  (via drill 0.3)
  Top 0.254: v22.35,27.56 22.86,28.07 23.62,28.07 U3.26 | v8.38,3.94 7.37,4.95 7.37,5.46 6.35,5.46 R12.2
  Route2 0.254: v21.34,15.88 22.35,16.89 v22.35,27.56
  Route15 0.254: v8.38,3.94 9.91,3.94 14.73,8.76 14.99,8.76 17.02,10.8 17.02,11.56 v21.34,15.88
  Bottom 0.254: v21.34,15.88 21.34,15.11 U$5.CD
N$25  (via drill 0.3)
  Top 0.254: 21.34,18.16 20.32,18.16 C15.1 | 21.34,18.16 22.86,18.16 24.38,16.64 FB1.1 | v10.67,24 10.67,22.23 10.16,21.72 10.16,16.89 9.91,16.64 C6.1 | v21.34,18.92 21.34,18.16
  Bottom 0.254: v10.67,24 13.21,24 14.22,25.02 14.22,25.78 U2.13 14.48,26.04 14.48,27.05 16.76,27.05 19.81,24 21.34,24 v21.34,18.92
N$26  (via drill 0.3)
  Top 0.254: v8.38,11.56 8.38,12.57 8.13,12.83 R14.1 | v16.51,11.3 16.26,11.56 16.26,14.86 14.48,16.64 R13.2 | v4.32,13.34 4.32,11.81 4.06,11.56 C11.2
  Bottom 0.254: v16.51,11.3 10.92,11.3 10.67,11.05 8.89,11.05 v8.38,11.56 6.1,11.56 v4.32,13.34
N$27  (via drill 0.3)
  Top 0.254: v11.18,13.59 12.19,14.61 R16.1 | v17.02,13.84 18.29,15.11 18.29,19.94 R15.2 | v3.56,9.53 3.56,8 3.81,7.75 C12.2
  Bottom 0.254: v17.02,13.84 11.43,13.84 v11.18,13.59 10.67,14.1 3.56,14.1 v3.56,9.53
N$28  (via drill 0.3)
  Top 0.254: C17.1 22.61,21.72 22.61,23.5 C10.1 22.35,23.5 v21.34,24.51
  Bottom 0.254: v21.34,24.51 18.29,27.56 13.72,27.56 13.72,26.04 U2.12
N$29  (via drill 0.3)
  Top 0.254: v2.03,9.78 1.27,9.02 1.27,7.75 C12.1
  Route2 0.254: v8.64,19.18 2.03,12.57 v2.03,9.78
  Bottom 0.254: v8.64,19.18 9.14,19.18 12.19,22.23 16.26,22.23 16.26,25.78 U2.16
N$30  (via drill 0.3)
  Top 0.254: v2.79,23.5 3.05,23.24 3.05,14.35 1.27,12.57 1.27,11.56 C11.1
  Bottom 0.254: v2.79,23.5 14.99,23.5 14.99,25.78 U2.14
N$31  (via drill 0.3)
  Top 0.254: U$1.VIN 9.14,18.92 7.87,17.65 6.1,17.65 6.1,16.89 Q1.2 6.1,16.64 6.1,16.38 v6.86,15.62 | v2.54,18.67 1.78,18.67 CR1.2 | v18.29,52.71 18.29,56.52 J3.P$3
  Route15 0.254: v18.29,52.71 18.29,33.91 4.57,20.19 4.57,19.94 4.32,19.69 3.56,19.69 v2.54,18.67
  Bottom 0.254: v2.54,18.67 5.59,15.62 v6.86,15.62
N$34  (via drill 0.3)
  Top 0.254: 22.86,19.43 24.38,20.96 24.38,21.21 | 22.86,19.43 22.61,19.18 FB2.1 22.86,19.43 | 24.38,21.72 24.38,21.21 | 24.38,21.72 24.38,23.5 C10.2 | 24.38,21.72 C17.2 24.38,21.21 | 24.38,21.21 25.4,20.19 25.4,3.43 23.88,3.43 X2.1 | C6.2 7.87,16.64 7.87,14.86 C8.2 7.87,14.61 v6.86,13.59 | v11.18,12.83 C9.2 | v10.92,15.37 12.19,16.64 R13.1 | v15.75,24.51 18.29,21.97 R15.1 18.54,22.23 20.32,22.23 C15.2 20.32,21.97 22.86,19.43
  Route2 0.254: v11.18,12.83 10.67,13.34 10.67,15.11 v10.92,15.37 16.76,15.37 16.76,17.91 17.53,18.67 17.53,22.73 v15.75,24.51
  Bottom 0.254: v6.86,13.59 7.62,12.83 v11.18,12.83 | v15.75,24.51 15.75,25.78 U2.15
OUTL  (via drill 0.3)
  Top 0.254: 9.91,12.83 9.91,14.61 C8.1 | v9.91,11.56 9.91,12.83 | v18.03,11.81 19.56,13.34 19.56,13.84 | 19.56,13.84 19.56,16.38 X2.4 | 9.91,12.83 R14.2 | 19.56,13.84 20.83,12.57 23.62,12.57 X2.2
  Bottom 0.254: v9.91,11.56 10.16,11.81 v18.03,11.81
OUTR  (via drill 0.3)
  Top 0.254: R16.2 14.22,14.61 14.22,12.83 C9.1 14.48,12.83 14.99,12.32 v14.99,10.8 | v18.03,9.02 17.02,8 17.02,5.21 X2.3 17.02,4.95 17.02,2.41 X2.5
  Bottom 0.254: v14.99,10.8 16.76,9.02 v18.03,9.02
PLL_IN  (via drill 0.3)
  Top 0.254: v11.18,10.8 11.18,11.56 12.95,11.56 13.97,10.54 R19.2
  Route15 0.254: v11.18,10.8 11.18,12.07 11.68,12.57 11.68,21.72 11.94,21.97 11.94,23.5 v12.95,24.51
  Bottom 0.254: v12.95,24.51 12.45,25.02 12.45,25.78 U2.10
SYSCLK_IN  (via drill 0.3)
  Top 0.254: v8.89,17.91 8.89,11.81 10.16,10.54 R18.2
  Bottom 0.254: v8.89,17.91 9.91,18.92 12.7,18.92 12.95,19.18 12.95,19.94 U2.6
WORDSEL_IN  (via drill 0.3)
  Top 0.254: v8.89,29.34 7.62,30.61 6.86,30.61 U3.11
  Route2 0.254: v16.76,18.67 8.89,26.54 v8.89,29.34
  Bottom 0.254: v16.76,18.67 15.75,18.67 15.75,19.94 U2.2